# EAGLE design hyundai_f (EAGLE 9.6.2)
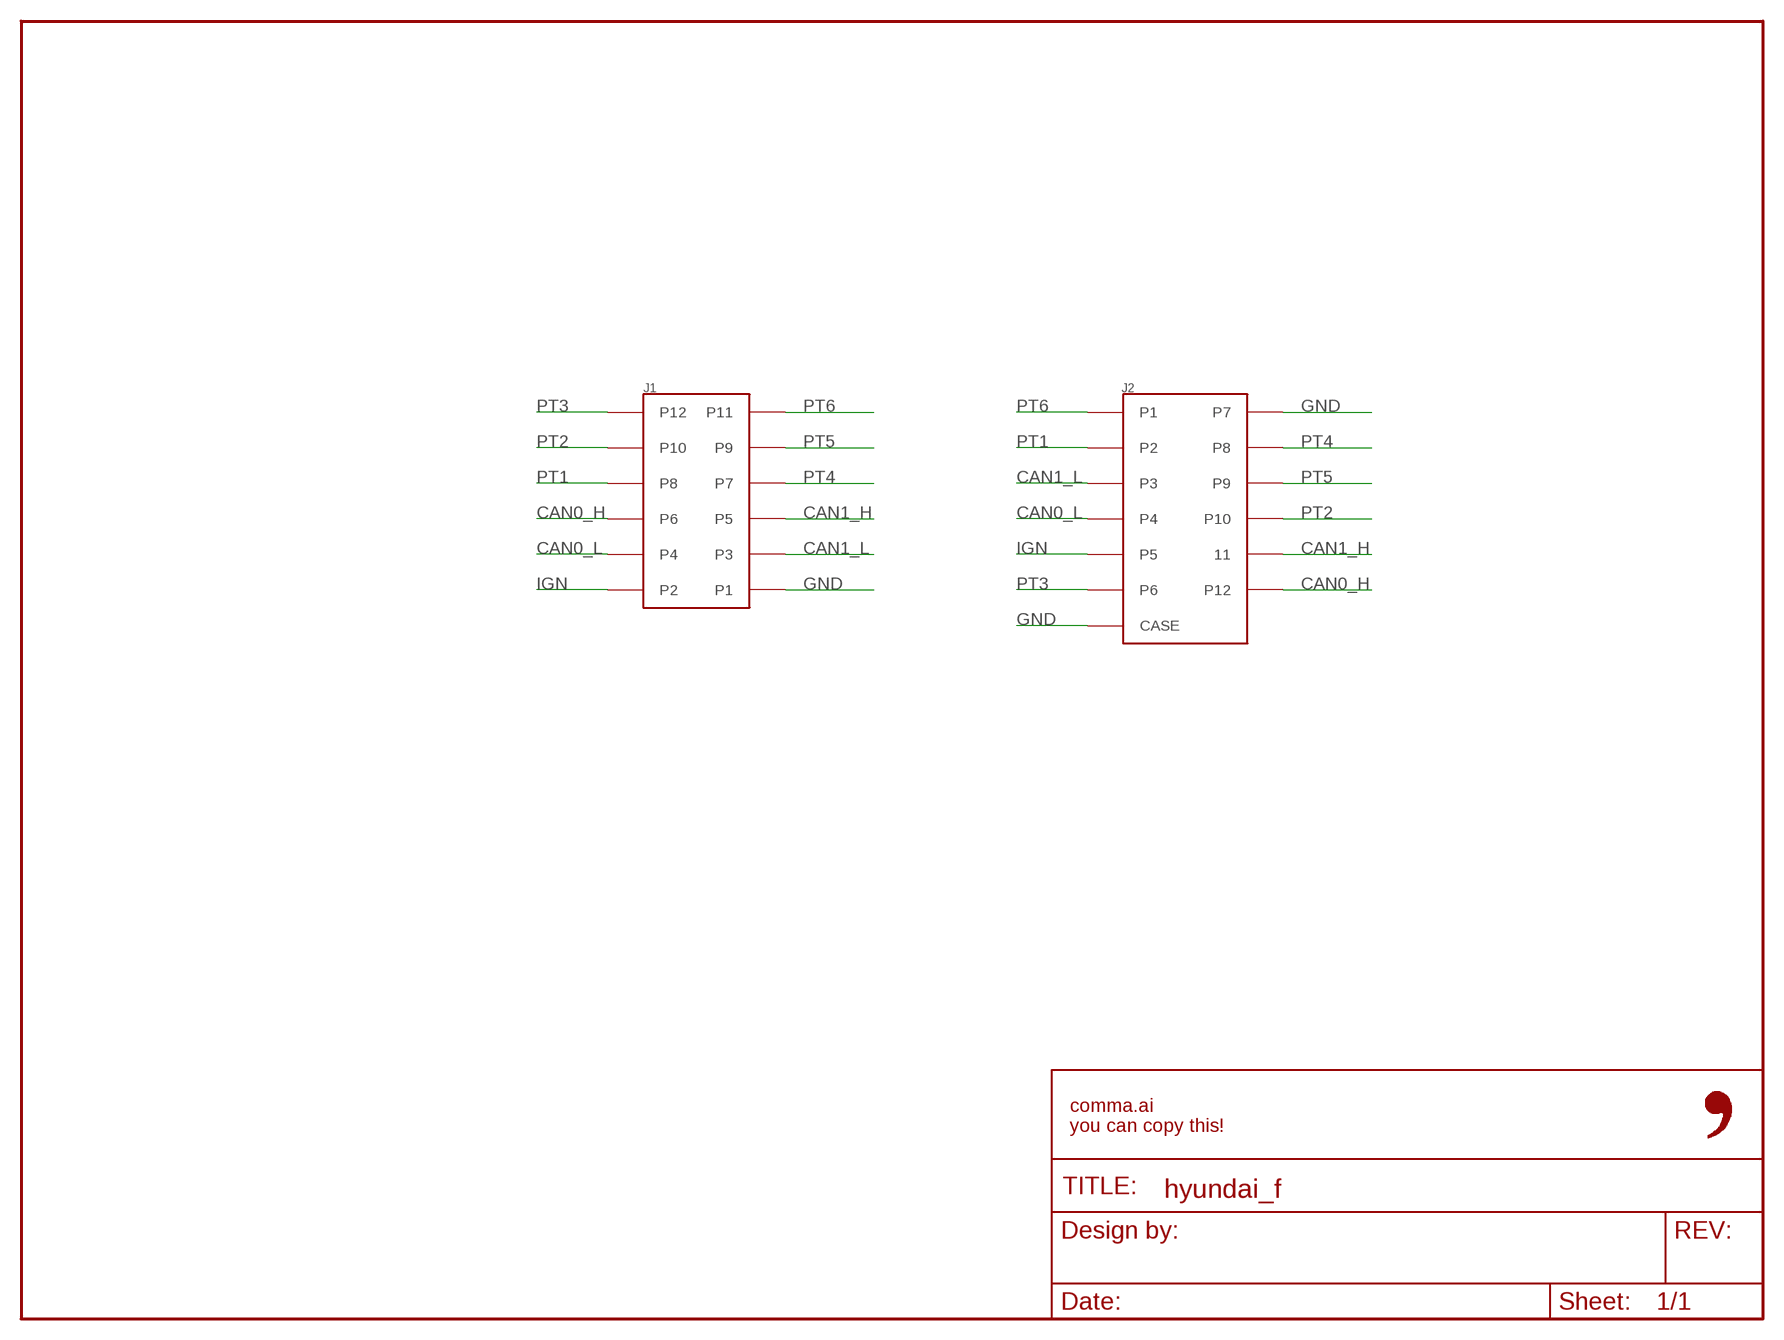
[diagram p0: schematic, sheet 1]

## Parts
FRAME1  FRAME-LETTER-OPENNO_PACKAGE  [DUMMY]
J1  5018761240  [5018761240]
J2  MG645845  [MG645845]

## Nets
CAN0_H: J1.P6 J2.P12
CAN0_L: J1.P4 J2.P4
CAN1_H: J1.P5 J2.P11
CAN1_L: J1.P3 J2.P3
GND: J1.P1 J2.P7 J2.P$1(CASE) J2.P$2(CASE)
IGN: J1.P2 J2.P5
PT1: J1.P8 J2.P2
PT2: J1.P10 J2.P10
PT3: J1.P12 J2.P6
PT4: J1.P7 J2.P8
PT5: J1.P9 J2.P9
PT6: J1.P11 J2.P1

## Library data of the parts
FRAME1 = comma.ai:FRAME-LETTER-OPEN: Schematic Frame - Letter Standard 8.5x11 US Letter frame; DESIGNER: Nobody; VERSION: v01
J1 = comma.ai:5018761240; CPN: CAI-HARNESS-MOLEX-5018761240
J2 = comma.ai:MG645845; CPN: CAI-HARNESS-KET-MG645866-5

## Board
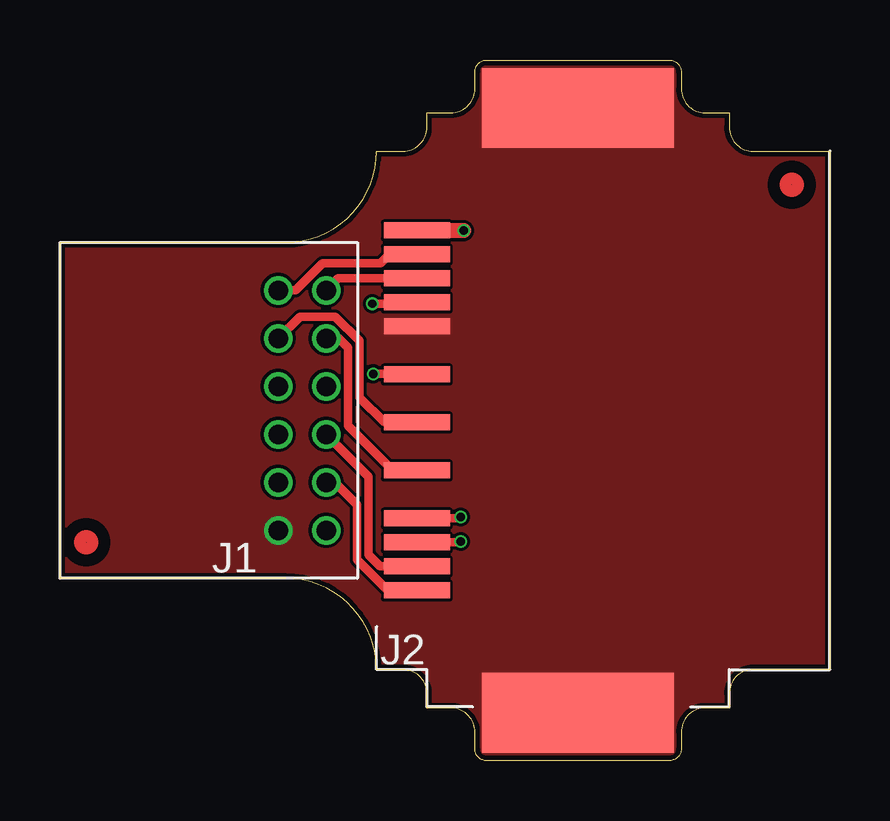
[diagram p1: board, top side]
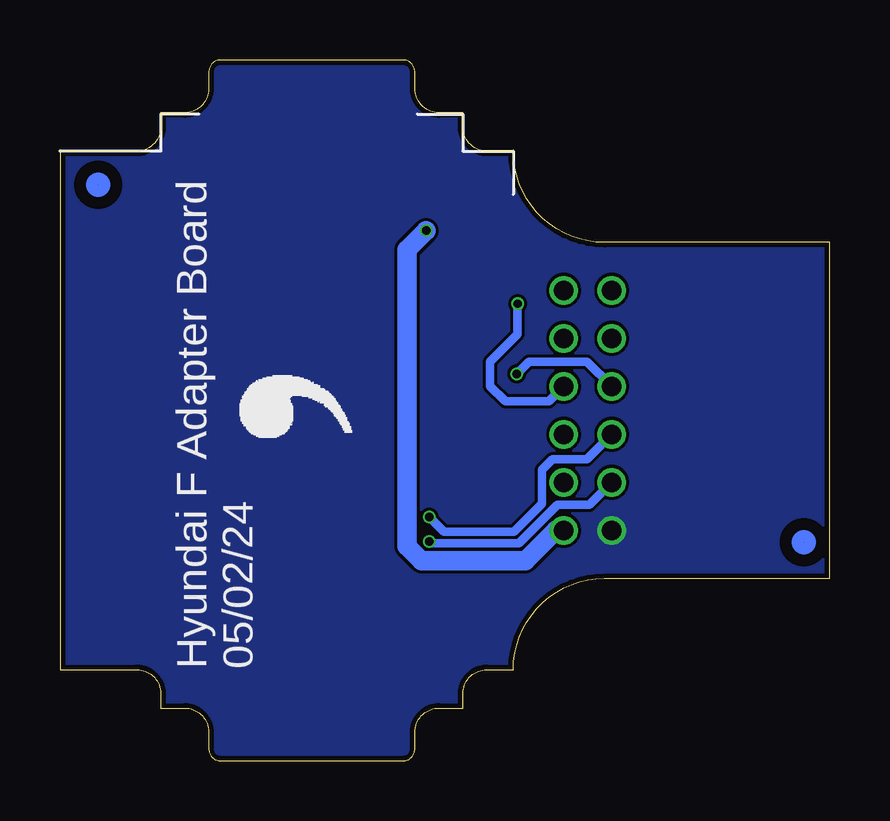
[diagram p2: board, bottom side, seen from below]

Size 32.1 x 29.2 mm. Coordinates in mm from the lower left corner, seen from the top.
Outline: 0,21.6 9.4,21.6 arc90 13.2,25.4 14.3,25.4 arc90 15.3,26.4 15.3,27 16.3,27 arc90 17.3,28 17.3,28.7 arc-90 17.8,29.2 25.4,29.2 arc-90 25.9,28.7 25.9,28 arc90 26.9,27 27.9,27 27.9,26.4 arc90 28.9,25.4 32.1,25.4 32.1,3.8 28.9,3.8 arc90 27.9,2.8 27.9,2.2 26.9,2.2 arc90 25.9,1.2 25.9,0.5 arc-90 25.4,0 17.8,0 arc-90 17.3,0.5 17.3,1.2 arc90 16.3,2.2 15.3,2.2 15.3,2.8 arc90 14.3,3.8 13.2,3.8 arc90 9.4,7.6 0,7.6 0,21.6
Copper layers (1*16): Top 0.035mm / dielectric 1.5mm / Bottom 0.035mm
Design rules "jlcpcb_2layer": minimum track width 5mil, minimum drill 12mil, track to track 5mil, track to pad 5mil, pad to pad 5mil, via to via 5mil, smd to smd 5mil, copper to edge 8mil, drill to drill 8mil, minimum pad ring 3mil, minimum via ring 3mil, stop-mask expansion 4mm, vias tented up to drill 20mil, thermal gap 10mil

### Footprints (pad centres in the part's own frame; a part is rotated, then mirrored left to right if it is on the bottom)
5018761240 = drill 0.8: P1 5,-1; P2 5,1; P3 3,-1; P4 3,1; P5 1,-1; P6 1,1; P7 -1,-1; P8 -1,1; P9 -3,-1; P10 -3,1; P11 -5,-1; P12 -5,1
MG645845 = smd 0.66 x 2.75: P1 6.5,6.72; P2 4.5,6.72; P3 -5.5,6.72; P4 -7.5,6.72; P5 7.5,6.72; P6 5.5,6.72; P7 3.5,6.72; P8 1.5,6.72; P9 -0.5,6.72; P10 -2.5,6.72; P11 -4.5,6.72; P12 -6.5,6.72 | smd 3.32 x 8: P$1 -12.6,0; P$2 12.6,0

### Placement (x,y rotation side)
FRAME1  1.21,-0.64 0 top
J1  10.1,14.6 270 top
J2  21.6,14.6 90 top
U$1  [LOGO]  19.62,12.79 90 bottom
U$2  [FIDUCIAL]  30.5,24 0 top
U$3  [FIDUCIAL]  1.1,9.1 0 top

### Tracks (layer width: path | path; a pad name or v marks a point on that pad's centre or on a via)
CAN0_H
  Top 0.356: J2.P12 13.34,8.1 12.87,8.58 12.87,11.83 J1.P6
CAN0_L
  Top 0.356: J1.P4 11.45,11.6 12.39,10.66 12.39,8.38 13.66,7.1 J2.P4
CAN1_H  (via drill 0.35)
  Top 0.356: v16.7,10.15 16.65,10.1 J2.P11
  Bottom 0.356: J1.P5 10.13,12.57 11.57,12.57 12,12.14 12,10.71 13.17,9.54 16.09,9.54 v16.7,10.15
CAN1_L  (via drill 0.35)
  Top 0.356: v16.7,9.14 16.66,9.1 J2.P3
  Bottom 0.356: J1.P3 10.04,10.66 11.37,10.66 12.97,9.06 16.63,9.06 v16.7,9.14
GND
  pour Top (no thermals): -1.9,30.6 34.1,30.6 34.1,-1.4 -1.9,-1.4
  pour Bottom (no thermals): -2.9,31.6 35.1,31.6 35.1,-2.4 -2.9,-2.4
IGN  (via drill 0.35)
  Top 0.635: v16.83,22.09 J2.P5
  Bottom 0.813: J1.P2 11.43,9.6 12.68,8.34 17.03,8.34 17.63,8.94 17.63,21.3 v16.83,22.09
PT1  (via drill 0.35)
  Top 0.356: v13.02,19.05 14.82,19.05 J2.P2
  Bottom 0.356: J1.P8 11.72,14.98 13.53,14.98 14.16,15.62 14.16,16.63 13.02,17.77 v13.02,19.05
PT2
  Top 0.356: J2.P10 13.87,12.1 12,13.96 12,17.2 11.61,17.6 J1.P10
PT3
  Top 0.356: J1.P12 11.6,20.1 J2.P6
PT4  (via drill 0.35)
  Top 0.356: v13.05,16.12 14.86,16.12 J2.P8
  Bottom 0.356: J1.P7 10.13,16.63 12.55,16.63 v13.05,16.12
PT5
  Top 0.356: J2.P9 13.52,14.1 12.49,15.13 12.49,17.49 11.47,18.5 10,18.5 J1.P9
PT6
  Top 0.356: J2.P1 13.74,21.1 13.37,20.73 10.96,20.73 9.82,19.6 J1.P11

### Text on the board
bNames: Hyundai F Adapter Board / 05/02/24